# Altium schematic sheet ButtonDaughter.SchDoc
size Letter; SheetNumber: 1; SheetTotal: 1
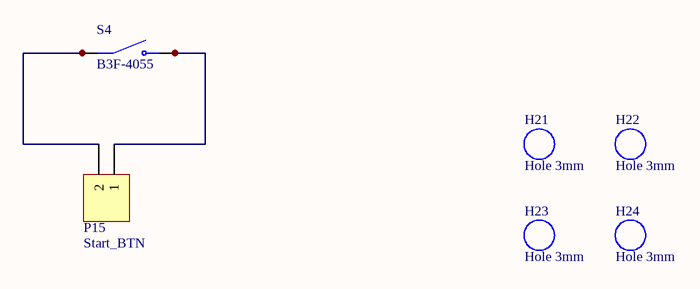
[diagram p0: ButtonDaughter.SchDoc]

## Parts
H21  Hole 3mm  [Hole 3mm]
H22  Hole 3mm  [Hole 3mm]
H23  Hole 3mm  [Hole 3mm]
H24  Hole 3mm  [Hole 3mm]
P15  Start_BTN  [HDR1X2]
S4  B3F-4055  [SW_B3F-4055]

## Nets
NetP15_1: P15.1 S4.3(NO) S4.4(NO)
NetP15_2: P15.2 S4.1(COM) S4.2(COM)

## Library data of the parts
P15 = Header 2H: Header, 2-Pin, Right Angle; LatestRevisionDate: 17-Jul-2002; LatestRevisionNote: Re-released for DXP Platform.; Publisher: Altium Limited
S4 = B3F-4055: Price: None; MP: B3F-4055; Availability: Unavailable; Value: *; Package: None